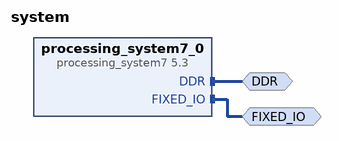
[diagram p0: block diagram of the top level]
# Vivado block design system, Vivado 2013.4
create_bd_design system

create_bd_intf_port -mode Master -vlnv xilinx.com:interface:ddrx_rtl:1.0 DDR
create_bd_intf_port -mode Master -vlnv xilinx.com:display_processing_system7:fixedio_rtl:1.0 FIXED_IO

create_bd_cell -type ip -vlnv xilinx.com:ip:processing_system7:5.3 processing_system7_0
set_property -dict [list \
  CONFIG.PCW_USE_M_AXI_GP0 0 \
  CONFIG.PCW_EN_CLK0_PORT 0 \
  CONFIG.PCW_EN_RST0_PORT 0 \
  CONFIG.PCW_IMPORT_BOARD_PRESET C:/xup/embedded/sources/ps7_system_prj.xml \
  CONFIG.PCW_UART1_PERIPHERAL_ENABLE 1 \
] [get_bd_cells processing_system7_0]
# 2 more settings of processing_system7_0 are not shown: defaults, MIO pin electricals, DDR timing, and values the tool derives

# ---- connections ----

connect_bd_intf_net [get_bd_intf_ports DDR] [get_bd_intf_pins processing_system7_0/DDR]
connect_bd_intf_net [get_bd_intf_ports FIXED_IO] [get_bd_intf_pins processing_system7_0/FIXED_IO]

validate_bd_design
save_bd_design
